# Altium schematic sheet ThreePhaseMLI.SchDoc
size 900 x 400 mm
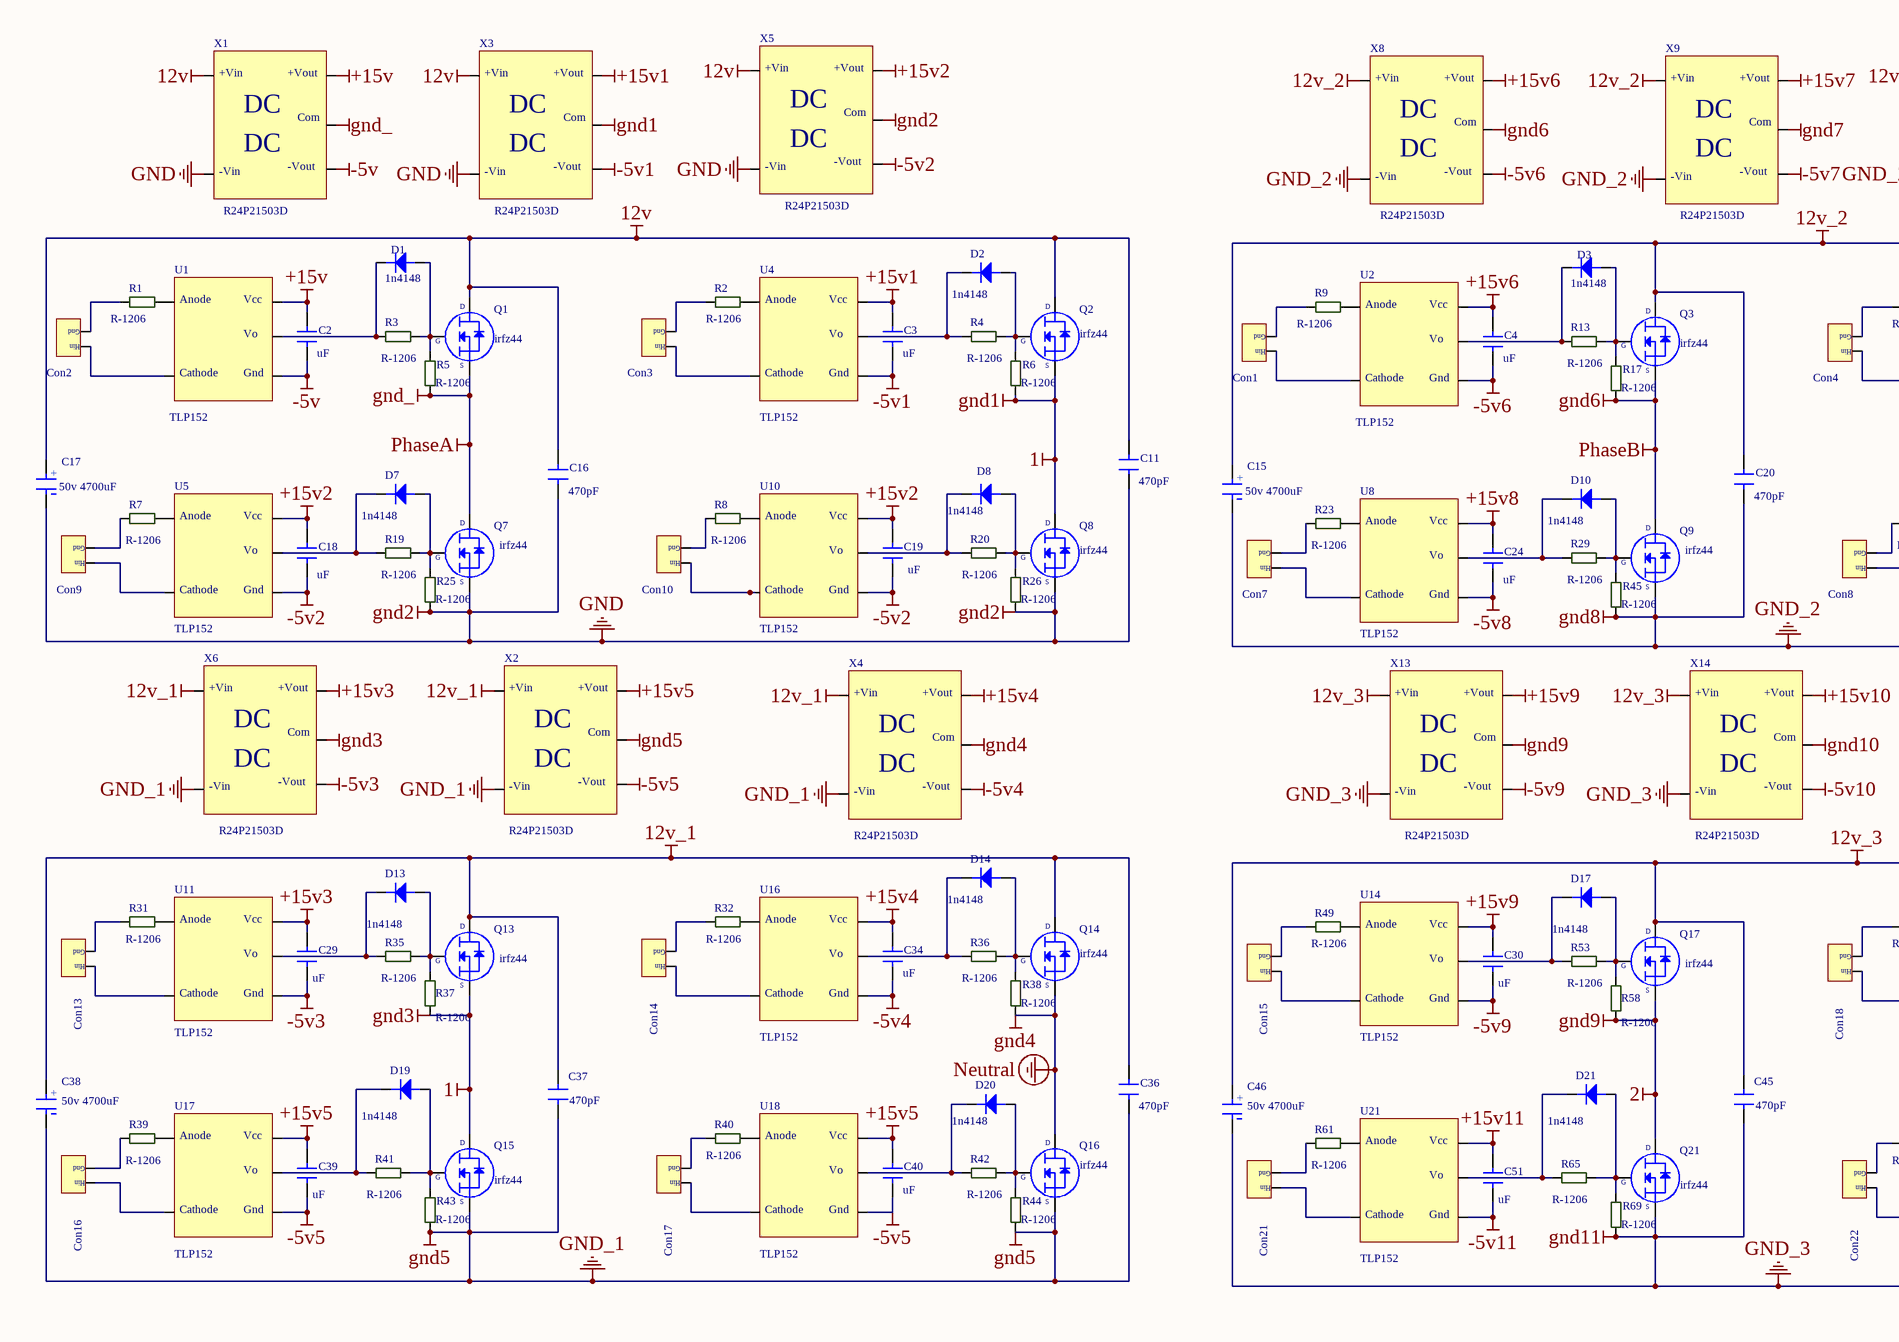
[diagram p0: ThreePhaseMLI.SchDoc, left]
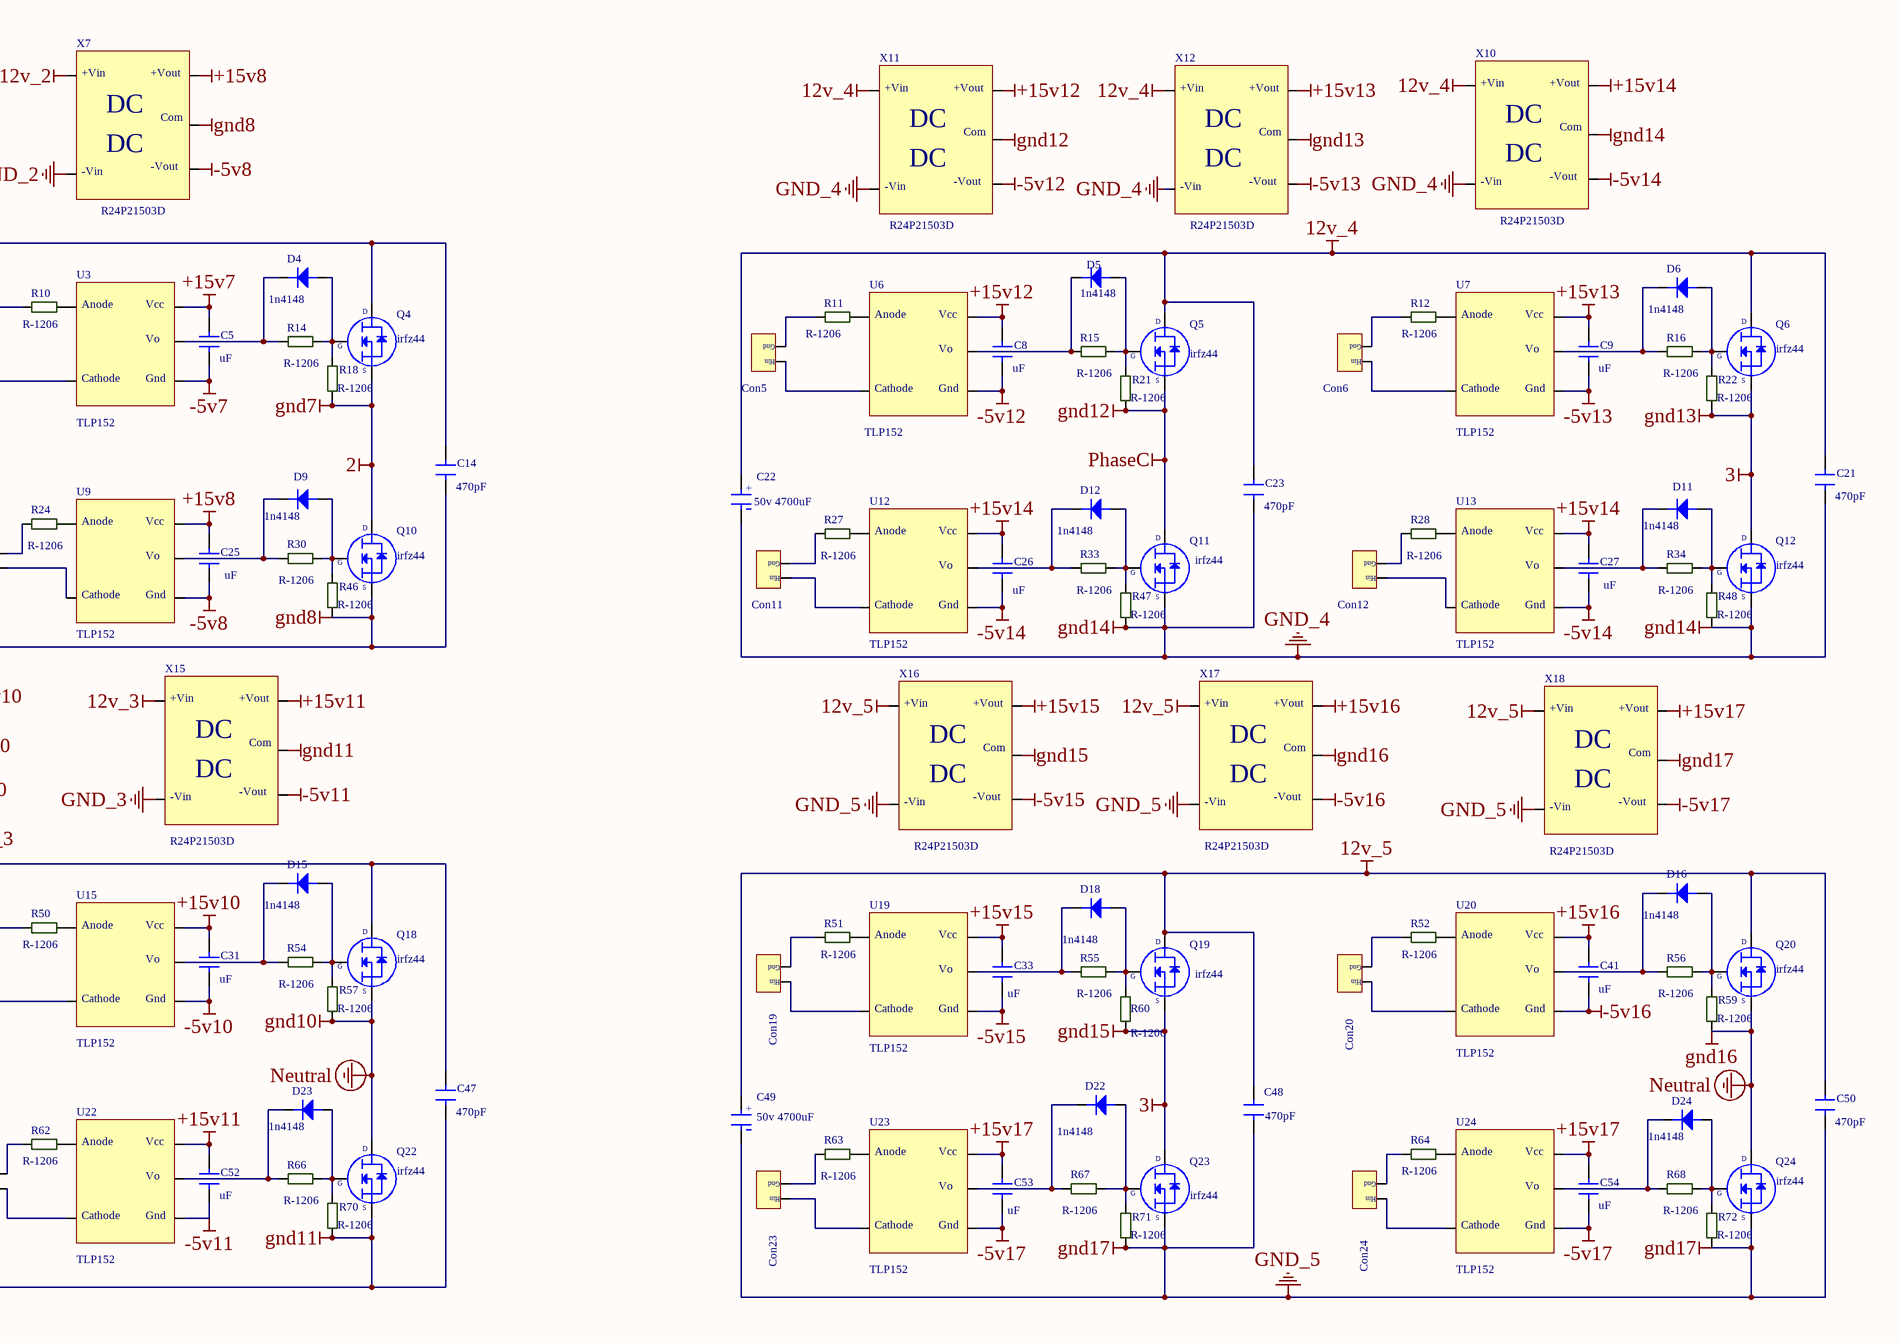
[diagram p1: ThreePhaseMLI.SchDoc, right]

## Parts
C2  uF  [C-1206]
C3  uF  [C-1206]
C4  uF  [C-1206]
C5  uF  [C-1206]
C8  uF  [C-1206]
C9  uF  [C-1206]
C11  470pF  [100v 470pF]
C14  470pF  [100v 470pF]
C15  50v 4700uF  [63v 2200uF]
C16  470pF  [100v 470pF]
C17  50v 4700uF  [63v 2200uF]
C18  uF  [C-1206]
C19  uF  [C-1206]
C20  470pF  [100v 470pF]
C21  470pF  [100v 470pF]
C22  50v 4700uF  [63v 2200uF]
C23  470pF  [100v 470pF]
C24  uF  [C-1206]
C25  uF  [C-1206]
C26  uF  [C-1206]
C27  uF  [C-1206]
C29  uF  [C-1206]
C30  uF  [C-1206]
C31  uF  [C-1206]
C33  uF  [C-1206]
C34  uF  [C-1206]
C36  470pF  [100v 470pF]
C37  470pF  [100v 470pF]
C38  50v 4700uF  [63v 2200uF]
C39  uF  [C-1206]
C40  uF  [C-1206]
C41  uF  [C-1206]
C45  470pF  [100v 470pF]
C46  50v 4700uF  [63v 2200uF]
C47  470pF  [100v 470pF]
C48  470pF  [100v 470pF]
C49  50v 4700uF  [63v 2200uF]
C50  470pF  [100v 470pF]
C51  uF  [C-1206]
C52  uF  [C-1206]
C53  uF  [C-1206]
C54  uF  [C-1206]
Con1  Connector2  [Conn]  (value not drawn)
Con2  Connector2  [Conn]  (value not drawn)
Con3  Connector2  [Conn]  (value not drawn)
Con4  Connector2  [Conn]  (value not drawn)
Con5  Connector2  [Conn]  (value not drawn)
Con6  Connector2  [Conn]  (value not drawn)
Con7  Connector2  [Conn]  (value not drawn)
Con8  Connector2  [Conn]  (value not drawn)
Con9  Connector2  [Conn]  (value not drawn)
Con10  Connector2  [Conn]  (value not drawn)
Con11  Connector2  [Conn]  (value not drawn)
Con12  Connector2  [Conn]  (value not drawn)
Con13  Connector2  [Conn]  (value not drawn)
Con14  Connector2  [Conn]  (value not drawn)
Con15  Connector2  [Conn]  (value not drawn)
Con16  Connector2  [Conn]  (value not drawn)
Con17  Connector2  [Conn]  (value not drawn)
Con18  Connector2  [Conn]  (value not drawn)
Con19  Connector2  [Conn]  (value not drawn)
Con20  Connector2  [Conn]  (value not drawn)
Con21  Connector2  [Conn]  (value not drawn)
Con22  Connector2  [Conn]  (value not drawn)
Con23  Connector2  [Conn]  (value not drawn)
Con24  Connector2  [Conn]  (value not drawn)
D1  1n4148  [B5819]
D2  1n4148  [B5819]
D3  1n4148  [B5819]
D4  1n4148  [B5819]
D5  1n4148  [B5819]
D6  1n4148  [B5819]
D7  1n4148  [B5819]
D8  1n4148  [B5819]
D9  1n4148  [B5819]
D10  1n4148  [B5819]
D11  1n4148  [B5819]
D12  1n4148  [B5819]
D13  1n4148  [B5819]
D14  1n4148  [B5819]
D15  1n4148  [B5819]
D16  1n4148  [B5819]
D17  1n4148  [B5819]
D18  1n4148  [B5819]
D19  1n4148  [B5819]
D20  1n4148  [B5819]
D21  1n4148  [B5819]
D22  1n4148  [B5819]
D23  1n4148  [B5819]
D24  1n4148  [B5819]
Q1  irfz44  [DPAK_TO263]
Q2  irfz44  [DPAK_TO263]
Q3  irfz44  [DPAK_TO263]
Q4  irfz44  [DPAK_TO263]
Q5  irfz44  [DPAK_TO263]
Q6  irfz44  [DPAK_TO263]
Q7  irfz44  [DPAK_TO263]
Q8  irfz44  [DPAK_TO263]
Q9  irfz44  [DPAK_TO263]
Q10  irfz44  [DPAK_TO263]
Q11  irfz44  [DPAK_TO263]
Q12  irfz44  [DPAK_TO263]
Q13  irfz44  [DPAK_TO263]
Q14  irfz44  [DPAK_TO263]
Q15  irfz44  [DPAK_TO263]
Q16  irfz44  [DPAK_TO263]
Q17  irfz44  [DPAK_TO263]
Q18  irfz44  [DPAK_TO263]
Q19  irfz44  [DPAK_TO263]
Q20  irfz44  [DPAK_TO263]
Q21  irfz44  [DPAK_TO263]
Q22  irfz44  [DPAK_TO263]
Q23  irfz44  [DPAK_TO263]
Q24  irfz44  [DPAK_TO263]
R1  R-1206  [R-1206]
R2  R-1206  [R-1206]
R3  R-1206  [R-1206]
R4  R-1206  [R-1206]
R5  R-1206  [R-1206]
R6  R-1206  [R-1206]
R7  R-1206  [R-1206]
R8  R-1206  [R-1206]
R9  R-1206  [R-1206]
R10  R-1206  [R-1206]
R11  R-1206  [R-1206]
R12  R-1206  [R-1206]
R13  R-1206  [R-1206]
R14  R-1206  [R-1206]
R15  R-1206  [R-1206]
R16  R-1206  [R-1206]
R17  R-1206  [R-1206]
R18  R-1206  [R-1206]
R19  R-1206  [R-1206]
R20  R-1206  [R-1206]
R21  R-1206  [R-1206]
R22  R-1206  [R-1206]
R23  R-1206  [R-1206]
R24  R-1206  [R-1206]
R25  R-1206  [R-1206]
R26  R-1206  [R-1206]
R27  R-1206  [R-1206]
R28  R-1206  [R-1206]
R29  R-1206  [R-1206]
R30  R-1206  [R-1206]
R31  R-1206  [R-1206]
R32  R-1206  [R-1206]
R33  R-1206  [R-1206]
R34  R-1206  [R-1206]
R35  R-1206  [R-1206]
R36  R-1206  [R-1206]
R37  R-1206  [R-1206]
R38  R-1206  [R-1206]
R39  R-1206  [R-1206]
R40  R-1206  [R-1206]
R41  R-1206  [R-1206]
R42  R-1206  [R-1206]
R43  R-1206  [R-1206]
R44  R-1206  [R-1206]
R45  R-1206  [R-1206]
R46  R-1206  [R-1206]
R47  R-1206  [R-1206]
R48  R-1206  [R-1206]
R49  R-1206  [R-1206]
R50  R-1206  [R-1206]
R51  R-1206  [R-1206]
R52  R-1206  [R-1206]
R53  R-1206  [R-1206]
R54  R-1206  [R-1206]
R55  R-1206  [R-1206]
R56  R-1206  [R-1206]
R57  R-1206  [R-1206]
R58  R-1206  [R-1206]
R59  R-1206  [R-1206]
R60  R-1206  [R-1206]
R61  R-1206  [R-1206]
R62  R-1206  [R-1206]
R63  R-1206  [R-1206]
R64  R-1206  [R-1206]
R65  R-1206  [R-1206]
R66  R-1206  [R-1206]
R67  R-1206  [R-1206]
R68  R-1206  [R-1206]
R69  R-1206  [R-1206]
R70  R-1206  [R-1206]
R71  R-1206  [R-1206]
R72  R-1206  [R-1206]
U1  TLP152  [TLP152]
U2  TLP152  [TLP152]
U3  TLP152  [TLP152]
U4  TLP152  [TLP152]
U5  TLP152  [TLP152]
U6  TLP152  [TLP152]
U7  TLP152  [TLP152]
U8  TLP152  [TLP152]
U9  TLP152  [TLP152]
U10  TLP152  [TLP152]
U11  TLP152  [TLP152]
U12  TLP152  [TLP152]
U13  TLP152  [TLP152]
U14  TLP152  [TLP152]
U15  TLP152  [TLP152]
U16  TLP152  [TLP152]
U17  TLP152  [TLP152]
U18  TLP152  [TLP152]
U19  TLP152  [TLP152]
U20  TLP152  [TLP152]
U21  TLP152  [TLP152]
U22  TLP152  [TLP152]
U23  TLP152  [TLP152]
U24  TLP152  [TLP152]
X1  R24P21503D  [SIP7]
X2  R24P21503D  [SIP7]
X3  R24P21503D  [SIP7]
X4  R24P21503D  [SIP7]
X5  R24P21503D  [SIP7]
X6  R24P21503D  [SIP7]
X7  R24P21503D  [SIP7]
X8  R24P21503D  [SIP7]
X9  R24P21503D  [SIP7]
X10  R24P21503D  [SIP7]
X11  R24P21503D  [SIP7]
X12  R24P21503D  [SIP7]
X13  R24P21503D  [SIP7]
X14  R24P21503D  [SIP7]
X15  R24P21503D  [SIP7]
X16  R24P21503D  [SIP7]
X17  R24P21503D  [SIP7]
X18  R24P21503D  [SIP7]

## Nets
1: Q2.3 Q8.2 Q13.3 Q15.2 R6.1 R37.1 X3.6 X6.6  [also labelled gnd1, gnd3]
2: Q4.3 Q10.2 Q17.3 Q21.2 R18.1 R58.1 X9.6 X13.6  [also labelled gnd7, gnd9]
3: Q6.3 Q12.2 Q19.3 Q23.2 R22.1 R60.1 X12.6 X16.6  [also labelled gnd13, gnd15]
12v: C11.2 C16.2 C17.2 Q1.2 Q2.2 X1.1 X3.1 X5.1
12v_1: C36.2 C37.2 C38.2 Q13.2 Q14.2 X2.1 X4.1 X6.1
12v_2: C14.2 C15.2 C20.2 Q3.2 Q4.2 X7.1 X8.1 X9.1
12v_3: C45.2 C46.2 C47.2 Q17.2 Q18.2 X13.1 X14.1 X15.1
12v_4: C21.2 C22.2 C23.2 Q5.2 Q6.2 X10.1 X11.1 X12.1
12v_5: C48.2 C49.2 C50.2 Q19.2 Q20.2 X16.1 X17.1 X18.1
+15v: C2.2 U1.5 X1.7
+15v1: C3.2 U4.5 X3.7
+15v2: C18.2 C19.2 U5.5 U10.5 X5.7
+15v3: C29.2 U11.5 X6.7
+15v4: C34.2 U16.5 X4.7
+15v5: C39.2 C40.2 U17.5 U18.5 X2.7
+15v6: C4.2 U2.5 X8.7
+15v7: C5.2 U3.5 X9.7
+15v8: C24.2 C25.2 U8.5 U9.5 X7.7
+15v9: C30.2 U14.5 X13.7
+15v10: C31.2 U15.5 X14.7
+15v11: C51.2 C52.2 U21.5 U22.5 X15.7
+15v12: C8.2 U6.5 X11.7
+15v13: C9.2 U7.5 X12.7
+15v14: C26.2 C27.2 U12.5 U13.5 X10.7
+15v15: C33.2 U19.5 X16.7
+15v16: C41.2 U20.5 X17.7
+15v17: C53.2 C54.2 U23.5 U24.5 X18.7
-5v: C2.1 U1.3 X1.5
-5v1: C3.1 U4.3 X3.5
-5v2: C18.1 C19.1 U5.3 U10.3 X5.5
-5v3: C29.1 U11.3 X6.5
-5v4: C34.1 U16.3 X4.5
-5v5: C39.1 C40.1 U17.3 U18.3 X2.5
-5v6: C4.1 U2.3 X8.5
-5v7: C5.1 U3.3 X9.5
-5v8: C24.1 C25.1 U8.3 U9.3 X7.5
-5v9: C30.1 U14.3 X13.5
-5v10: C31.1 U15.3 X14.5
-5v11: C51.1 C52.1 U21.3 U22.3 X15.5
-5v12: C8.1 U6.3 X11.5
-5v13: C9.1 U7.3 X12.5
-5v14: C26.1 C27.1 U12.3 U13.3 X10.5
-5v15: C33.1 U19.3 X16.5
-5v16: C41.1 U20.3 X17.5
-5v17: C53.1 C54.1 U23.3 U24.3 X18.5
GND: C11.1 C16.1 C17.1 Q7.3 Q8.3 R25.1 R26.1 X1.2 X3.2 X5.2 X5.6  [also labelled gnd2]
gnd5: C36.1 C37.1 C38.1 Q15.3 Q16.3 R43.1 R44.1 X2.2 X2.6 X4.2 X6.2  [also labelled GND_1]
gnd6: Q3.3 Q9.2 R17.1 X8.6  [also labelled PhaseB]
gnd8: C14.1 C15.1 C20.1 Q9.3 Q10.3 R45.1 R46.1 X7.2 X7.6 X8.2 X9.2  [also labelled GND_2]
gnd10: Q14.3 Q16.2 Q18.3 Q20.3 Q22.2 Q24.2 R38.1 R57.1 R59.1 X4.6 X14.6 X17.6  [also labelled gnd16, gnd4, Neutral]
gnd11: C45.1 C46.1 C47.1 Q21.3 Q22.3 R69.1 R70.1 X13.2 X14.2 X15.2 X15.6  [also labelled GND_3]
gnd12: Q5.3 Q11.2 R21.1 X11.6  [also labelled PhaseC]
gnd14: C21.1 C22.1 C23.1 Q11.3 Q12.3 R47.1 R48.1 X10.2 X10.6 X11.2 X12.2  [also labelled GND_4]
gnd17: C48.1 C49.1 C50.1 Q23.3 Q24.3 R71.1 R72.1 X16.2 X17.2 X18.2 X18.6  [also labelled GND_5]
gnd_: Q1.3 Q7.2 R5.1 X1.6  [also labelled PhaseA]
NetCon1_1: Con1.1 U2.2
NetCon1_2: Con1.2 R9.1
NetCon2_1: Con2.1 U1.2
NetCon2_2: Con2.2 R1.1
NetCon3_1: Con3.1 U4.2
NetCon3_2: Con3.2 R2.1
NetCon4_1: Con4.1 U3.2
NetCon4_2: Con4.2 R10.1
NetCon5_1: Con5.1 U6.2
NetCon5_2: Con5.2 R11.1
NetCon6_1: Con6.1 U7.2
NetCon6_2: Con6.2 R12.1
NetCon7_1: Con7.1 U8.2
NetCon7_2: Con7.2 R23.1
NetCon8_1: Con8.1 U9.2
NetCon8_2: Con8.2 R24.1
NetCon9_1: Con9.1 U5.2
NetCon9_2: Con9.2 R7.1
NetCon10_1: Con10.1 U10.2
NetCon10_2: Con10.2 R8.1
NetCon11_1: Con11.1 U12.2
NetCon11_2: Con11.2 R27.1
NetCon12_1: Con12.1 U13.2
NetCon12_2: Con12.2 R28.1
NetCon13_1: Con13.1 U11.2
NetCon13_2: Con13.2 R31.1
NetCon14_1: Con14.1 U16.2
NetCon14_2: Con14.2 R32.1
NetCon15_1: Con15.1 U14.2
NetCon15_2: Con15.2 R49.1
NetCon16_1: Con16.1 U17.2
NetCon16_2: Con16.2 R39.1
NetCon17_1: Con17.1 U18.2
NetCon17_2: Con17.2 R40.1
NetCon18_1: Con18.1 U15.2
NetCon18_2: Con18.2 R50.1
NetCon19_1: Con19.1 U19.2
NetCon19_2: Con19.2 R51.1
NetCon20_1: Con20.1 U20.2
NetCon20_2: Con20.2 R52.1
NetCon21_1: Con21.1 U21.2
NetCon21_2: Con21.2 R61.1
NetCon22_1: Con22.1 U22.2
NetCon22_2: Con22.2 R62.1
NetCon23_1: Con23.1 U23.2
NetCon23_2: Con23.2 R63.1
NetCon24_1: Con24.1 U24.2
NetCon24_2: Con24.2 R64.1
NetD1_1: D1.1 R3.1 U1.4
NetD1_2: D1.2 Q1.1 R3.2 R5.2
NetD2_1: D2.1 R4.1 U4.4
NetD2_2: D2.2 Q2.1 R4.2 R6.2
NetD3_1: D3.1 R13.1 U2.4
NetD3_2: D3.2 Q3.1 R13.2 R17.2
NetD4_1: D4.1 R14.1 U3.4
NetD4_2: D4.2 Q4.1 R14.2 R18.2
NetD5_1: D5.1 R15.1 U6.4
NetD5_2: D5.2 Q5.1 R15.2 R21.2
NetD6_1: D6.1 R16.1 U7.4
NetD6_2: D6.2 Q6.1 R16.2 R22.2
NetD7_1: D7.1 R19.1 U5.4
NetD7_2: D7.2 Q7.1 R19.2 R25.2
NetD8_1: D8.1 R20.1 U10.4
NetD8_2: D8.2 Q8.1 R20.2 R26.2
NetD9_1: D9.1 R30.1 U9.4
NetD9_2: D9.2 Q10.1 R30.2 R46.2
NetD10_1: D10.1 R29.1 U8.4
NetD10_2: D10.2 Q9.1 R29.2 R45.2
NetD11_1: D11.1 R34.1 U13.4
NetD11_2: D11.2 Q12.1 R34.2 R48.2
NetD12_1: D12.1 R33.1 U12.4
NetD12_2: D12.2 Q11.1 R33.2 R47.2
NetD13_1: D13.1 R35.1 U11.4
NetD13_2: D13.2 Q13.1 R35.2 R37.2
NetD14_1: D14.1 R36.1 U16.4
NetD14_2: D14.2 Q14.1 R36.2 R38.2
NetD15_1: D15.1 R54.1 U15.4
NetD15_2: D15.2 Q18.1 R54.2 R57.2
NetD16_1: D16.1 R56.1 U20.4
NetD16_2: D16.2 Q20.1 R56.2 R59.2
NetD17_1: D17.1 R53.1 U14.4
NetD17_2: D17.2 Q17.1 R53.2 R58.2
NetD18_1: D18.1 R55.1 U19.4
NetD18_2: D18.2 Q19.1 R55.2 R60.2
NetD19_1: D19.1 R41.1 U17.4
NetD19_2: D19.2 Q15.1 R41.2 R43.2
NetD20_1: D20.1 R42.1 U18.4
NetD20_2: D20.2 Q16.1 R42.2 R44.2
NetD21_1: D21.1 R65.1 U21.4
NetD21_2: D21.2 Q21.1 R65.2 R69.2
NetD22_1: D22.1 R67.1 U23.4
NetD22_2: D22.2 Q23.1 R67.2 R71.2
NetD23_1: D23.1 R66.1 U22.4
NetD23_2: D23.2 Q22.1 R66.2 R70.2
NetD24_1: D24.1 R68.1 U24.4
NetD24_2: D24.2 Q24.1 R68.2 R72.2
NetR1_2: R1.2 U1.1
NetR2_2: R2.2 U4.1
NetR7_2: R7.2 U5.1
NetR8_2: R8.2 U10.1
NetR9_2: R9.2 U2.1
NetR10_2: R10.2 U3.1
NetR11_2: R11.2 U6.1
NetR12_2: R12.2 U7.1
NetR23_2: R23.2 U8.1
NetR24_2: R24.2 U9.1
NetR27_2: R27.2 U12.1
NetR28_2: R28.2 U13.1
NetR31_2: R31.2 U11.1
NetR32_2: R32.2 U16.1
NetR39_2: R39.2 U17.1
NetR40_2: R40.2 U18.1
NetR49_2: R49.2 U14.1
NetR50_2: R50.2 U15.1
NetR51_2: R51.2 U19.1
NetR52_2: R52.2 U20.1
NetR61_2: R61.2 U21.1
NetR62_2: R62.2 U22.1
NetR63_2: R63.2 U23.1
NetR64_2: R64.2 U24.1

## Notes on the sheet
- (in symbol Aluminum Electrolytic Capacitors) +
- (in symbol Connector2) Gnd; Hin
- (in symbol R24P21503D) +Vin; +Vout; DC; Com; -Vin; -Vout
- (in symbol TLP152(TPL,E) Anode; Vcc; Vo; Cathode; Gnd
- (in symbol To220 Mosfet) D; G; S

## Library data of the parts
C2-C5 C8 C9 C18 C19 C24-C27 C29-C31 C33 C34 C39-C41 C51-C54 = C-1206
C11 C14 C16 C20 C21 C23 C36 C37 C45 C47 C48 C50 = 100v 470p cap
C15 C17 C22 C38 C46 C49 = Aluminum Electrolytic Capacitors: PKL5-063V472MM450 Aluminum Electrolytic Capacitors - Snap In 63volts 4700uF 20%; Manufacturer: Nichicon; Manufacturer Part Number: LKS1J472MESZ; Capacitance: 4.7mF; Voltage Rating: 63V; Ripple Current: 3A; Life (Hours): 1000Hour; Supplier 1: Mouser; RoHS: Yes; Mount: Through Hole; Case/Package: Radial; Min Operating Temperature: -40°C; Max Operating Temperature: 85°C; Package Quantity: 250; Tolerance: 20%; Packaging: Bulk; Voltage Rating (DC): 63V; Termination: Snap in; Diameter: 22mm; Length: 45mm; Lead Pitch: 0.394inch; Height - Seated (Max): 1.772inch; Supplier Part Number 1: 647-LKS1J472MESZ; ComponentLink2Description: https://www.ozdisan.com/pasif-komponentler/kondansatorler/aluminyum-kondansatorler/PKL5-063V472MM450; ComponentLink2URL: https://www.ozdisan.com/pasif-komponentler/kondansatorler/aluminyum-kondansatorler/PKL5-063V472MM450
D1-D24 = 1N4148W-E3-18: Diode Small Signal Switching 100V 0.15A 2-Pin SOD-123 T/R; Manufacturer: Vishay; Recovery Time: 4ns; Max Power Dissipation: 350mW; Forward Current: 150mA; Max Surge Current: 2A; Forward Voltage: 1.2V; Max Reverse Leakage Current: 5uA; Element Configuration: Single; Max Reverse Voltage (DC): 75V; Peak Reverse Current: 100uA; Supplier 1: Allied Electronics; Manufacturer Part Number: 1N4148W-E3-18; RoHS: Yes; Stock 1: 6838; Pricing 1: 1 = 0.03900, 25 = 0.03800, 100 = 0.03600, 250 = 0.03400, 500 = 0.03200, 1000 = 0.03100, 2500 = 0.02900 (USD); Mount: Surface Mount; Number of Pins: 2; Weight: 0.000363oz; Contact Plating: Tin; Min Operating Temperature: -55°C; Max Operating Temperature: 150°C; Packaging: Tape and Reel; Package Quantity: 10000; Average Rectified Current: 150mA; Reverse Recovery Time: 4ns; Power Dissipation: 350mW; Max Repetitive Reverse Voltage (Vrrm): 100V; Peak Non-Repetitive Surge Current: 2A; Length: 2.85mm; Height: 1.25mm; Width: 1.7mm; Radiation Hardening: No; Lead Free: Lead Free; ComponentLink1URL: https://datasheet.ciiva.com/29885/1n4148w-29885941.pdf?src-supplier=Avnet; ComponentLink1Description: https://datasheet.ciiva.com/29885/1n4148w-29885941.pdf?src-supplier=Avnet; ComponentLink2URL: https://datasheet.ciiva.com/29593/1n4148w-29593113.pdf?src-supplier=Digi-Key; ComponentLink2Description: https://datasheet.ciiva.com/29593/1n4148w-29593113.pdf?src-supplier=Digi-Key; ComponentLink3URL: https://datasheet.ciiva.com/29593/1n4148w-29593111.pdf?src-supplier=Digi-Key; ComponentLink3Description: https://datasheet.ciiva.com/29593/1n4148w-29593111.pdf?src-supplier=Digi-Key; ComponentLink4URL: https://datasheet.ciiva.com/29593/1n4148w-29593112.pdf?src-supplier=Digi-Key; ComponentLink4Description: https://datasheet.ciiva.com/29593/1n4148w-29593112.pdf?src-supplier=Digi-Key; Supplier Part Number 1: 70061597
Q1-Q24 = To220 Mosfet
R1-R72 = R-1206: Res1206
U1-U24 = TLP152(TPL,E: OPTOISO 3.75KV GATE DRIVER 6SO-5; Manufacturer: Toshiba; Number of Channels: 1; Propagation Delay: 165ns; Max Power Dissipation: 260mW; Direction: Unidirectional; Turn-On Delay Time: 190ns; Fall Time: 22ns; Forward Voltage: 1.57V; Output Current: 2.5A; Forward Current: 10mA; Rise Time: 18ns; High Level Output Current: 2A; Pulse Width Distortion (PWD): 50ns; Supplier 1: Mouser; Manufacturer Part Number: TLP152(TPL,E; RoHS: Yes; Stock 1: 22321; Pricing 1: 1 = 1.55000, 10 = 0.96800, 50 = 0.96800, 100 = 0.87200, 1000 = 0.54300, 10000 = 0.44000 (USD); Mount: Surface Mount; Case/Package: SO; Number of Pins: 5; Min Operating Temperature: -40°C; Max Operating Temperature: 100°C; Packaging: Tape and Reel; Package Quantity: 3000; Low Level Output Current: 2A; Max Output Current: 2.5A; ComponentLink1URL: https://datasheet.ciiva.com/41848/tlp152-datasheet-en-20120914-41848928.pdf?src-supplier=Digi-Key; ComponentLink1Description: https://datasheet.ciiva.com/41848/tlp152-datasheet-en-20120914-41848928.pdf?src-supplier=Digi-Key; Supplier Part Number 1: 757-TLP152TPLE
X1-X18 = R24P21503D: DC/DC CONV 2W 12VDC +15/-3VDC 93mA/-185mA SIP7; Manufacturer: RECOM; Özdisan Part Number: R12P21503D; Link: https://www.ozdisan.com/guc-kaynaklari-adaptorler/izole-donusturucu-moduller/dcdc-donusturuculer/R12P21503D; Price: 11,27149
Con1-Con24 = Connector2: System: Connector